# Altium schematic sheet OVERVIEW.SchDoc
size A4; SheetNumber: 1; SheetTotal: 7
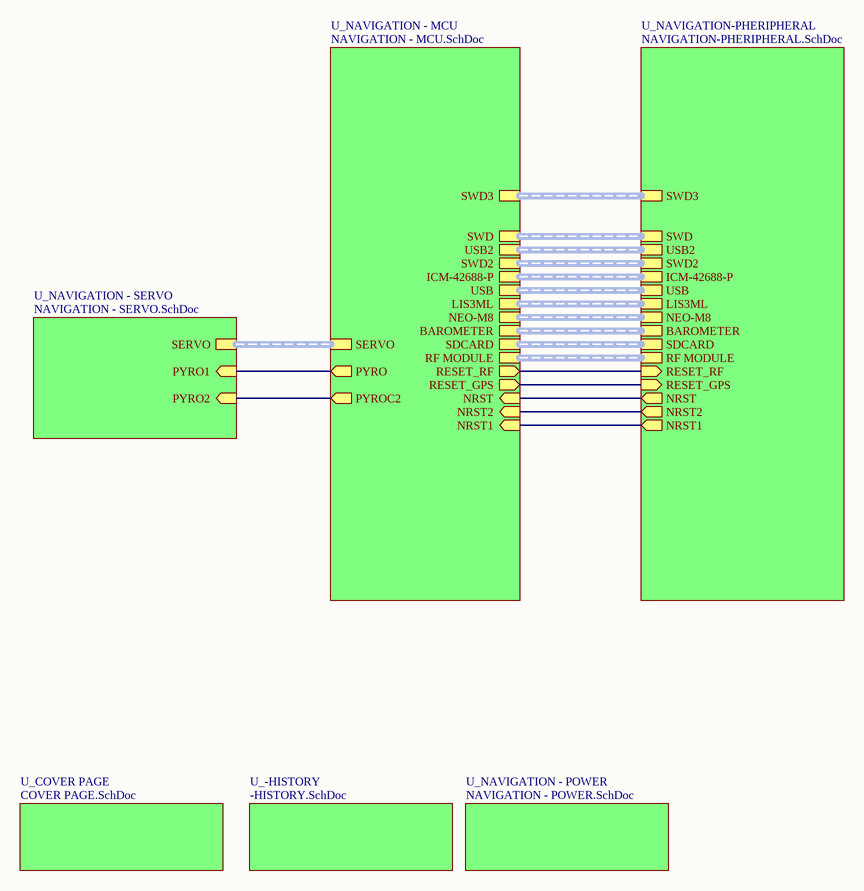
[diagram p0: OVERVIEW.SchDoc]

## Sub-sheets
U_-HISTORY = -HISTORY.SchDoc: no entries
U_COVER PAGE = COVER PAGE.SchDoc: no entries
U_NAVIGATION - MCU = NAVIGATION - MCU.SchDoc: SWD (harness JTAG), USB2 (harness USB2), SWD2 (harness JTAG2), ICM-42688-P (harness ICM-42688-P), USB (harness USB), LIS3ML (harness LIS3ML), NEO-M8 (harness NEO-M8), BAROMETER (harness BAROMETER), SDCARD (harness SDCARD), RF MODULE (harness RF MODULE), SERVO (harness SERVO), RESET_RF (out), RESET_GPS (out), NRST (in), SWD3 (harness JTAG3), NRST1 (in), NRST2 (in), PYRO (out), PYROC2 (out)
U_NAVIGATION - POWER = NAVIGATION - POWER.SchDoc: no entries
U_NAVIGATION - SERVO = NAVIGATION - SERVO.SchDoc: SERVO (harness SERVO), PYRO1 (in), PYRO2 (in)
U_NAVIGATION-PHERIPHERAL = NAVIGATION-PHERIPHERAL.SchDoc: NRST (out), USB (harness USB), RF MODULE (harness RF MODULE), USB2 (harness USB2), BAROMETER (harness BAROMETER), SDCARD (harness SDCARD), RESET_GPS (in), ICM-42688-P (harness ICM-42688-P), RESET_RF (in), SWD2 (harness JTAG2), LIS3ML (harness LIS3ML), SWD (harness JTAG), NEO-M8 (harness NEO-M8), NRST2 (out), SWD3 (harness JTAG2), NRST1 (out)

## Nets
(unnamed): sheet U_NAVIGATION - MCU/RESET_RF, sheet U_NAVIGATION-PHERIPHERAL/RESET_RF
(unnamed): sheet U_NAVIGATION - MCU/RESET_GPS, sheet U_NAVIGATION-PHERIPHERAL/RESET_GPS
(unnamed): sheet U_NAVIGATION - MCU/NRST, sheet U_NAVIGATION-PHERIPHERAL/NRST
(unnamed): sheet U_NAVIGATION - MCU/NRST1, sheet U_NAVIGATION-PHERIPHERAL/NRST1
(unnamed): sheet U_NAVIGATION - MCU/NRST2, sheet U_NAVIGATION-PHERIPHERAL/NRST2
(unnamed): sheet U_NAVIGATION - MCU/PYRO, sheet U_NAVIGATION - SERVO/PYRO1
(unnamed): sheet U_NAVIGATION - MCU/PYROC2, sheet U_NAVIGATION - SERVO/PYRO2

## Buses and harness runs
harness sheet U_NAVIGATION - MCU/BAROMETER = sheet U_NAVIGATION-PHERIPHERAL/BAROMETER
harness sheet U_NAVIGATION - MCU/ICM-42688-P = sheet U_NAVIGATION-PHERIPHERAL/ICM-42688-P
harness sheet U_NAVIGATION - MCU/LIS3ML = sheet U_NAVIGATION-PHERIPHERAL/LIS3ML
harness sheet U_NAVIGATION - MCU/NEO-M8 = sheet U_NAVIGATION-PHERIPHERAL/NEO-M8
harness sheet U_NAVIGATION - MCU/RF MODULE = sheet U_NAVIGATION-PHERIPHERAL/RF MODULE
harness sheet U_NAVIGATION - MCU/SDCARD = sheet U_NAVIGATION-PHERIPHERAL/SDCARD
harness sheet U_NAVIGATION - MCU/SERVO = sheet U_NAVIGATION - SERVO/SERVO
harness sheet U_NAVIGATION - MCU/SWD2 = sheet U_NAVIGATION-PHERIPHERAL/SWD2
harness sheet U_NAVIGATION - MCU/SWD3 = sheet U_NAVIGATION-PHERIPHERAL/SWD3
harness sheet U_NAVIGATION - MCU/SWD = sheet U_NAVIGATION-PHERIPHERAL/SWD
harness sheet U_NAVIGATION - MCU/USB2 = sheet U_NAVIGATION-PHERIPHERAL/USB2
harness sheet U_NAVIGATION - MCU/USB = sheet U_NAVIGATION-PHERIPHERAL/USB